# EAGLE schematic esquematicoEagle (EAGLE 9.6.2)
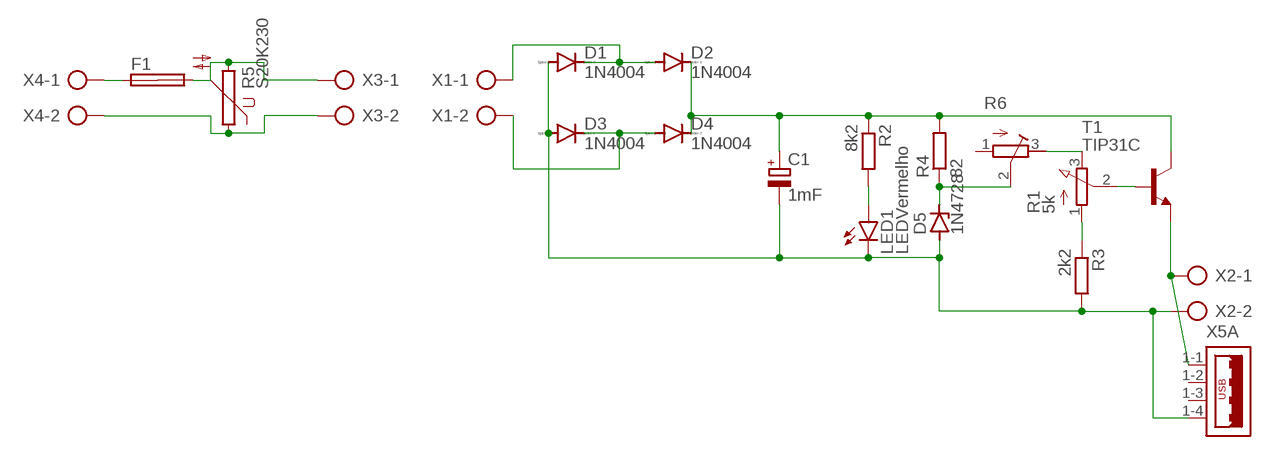
[diagram p0: schematic, sheet 1]

## Parts
C1  1mF  CPOL-EUE5-10.5  [E5-10,5]
D1  1N4004  [DO41-10]
D2  1N4004  [DO41-10]
D3  1N4004  [DO41-10]
D4  1N4004  [DO41-10]
D5  1N4728  [DO41Z10]
F1  SHK20L  [SHK20L]
LED1  LEDVermelho  LED5MM  [LED5MM]
R1  5k  3RP/1610N  [3RP/1610N]
R2  8k2  R-EU_0204/7  [0204/7]
R3  2k2  R-EU_0204/7  [0204/7]
R4  82  R-EU_0204/7  [0204/7]
R5  S20K230  [S20K230]
R6  R-TRIMM3296W  [RTRIM3296W]
T1  TIP31C  [TO220]
X1  AK500/2-H  [AK500/2-H]
X2  AK500/2-H  [AK500/2-H]
X3  AK500/2-H  [AK500/2-H]
X4  AK500/2-H  [AK500/2-H]
X5  USB_4-32003-40XA  [32003-40XA]

## Nets
N$1: C1.- D1.A D3.A D5.A LED1.K(C) R3.2 X2.2 X5.1-4
N$2: D1.C D2.A X1.1
N$3: C1.+ D2.C D4.C R2.1 R4.2 T1.2(C)
N$4: D3.C D4.A X1.2
N$5: LED1.A R2.2
N$6: D5.C R4.1 R6.2(S)
N$7: R1.3(E) R6.3(E)
N$8: R1.1(A) R3.1
N$9: R1.2(S) T1.1(B)
N$10: T1.3(E) X2.1 X5.1-1
N$11: F1.1A X4.1
N$12: R5.1 X3.2 X4.2
N$13: F1.2A R5.2 X3.1
Unconnected: F1.1B F1.2B R6.1(A) X5.1-2 X5.1-3 X5.2-1 X5.2-2 X5.2-3 X5.2-4 X5.3-1 X5.3-2 X5.3-3 X5.3-4 X5.4-1 X5.4-2 X5.4-3 X5.4-4

## Library data of the parts
C1 = rcl:CPOL-EU: POLARIZED CAPACITOR, European symbol; SPICEPREFIX: C
D1-D4 = diode:1N4004: DIODE general purpose rectifier, 1 A
D5 = diode:1N4728: Z DIODE 3.3 V, 1W, 5 percent
F1 = fuse:SHK20L: FUSE HOLDER 5 x 20 mm, SH contact, SHH1 Schukat, E1073 Buerklin; OC_FARNELL: unknown; OC_NEWARK: unknown
LED1 = led:LED: LED OSRAM: - CHIPLED LG R971, LG N971, LY N971, LG Q971, LY Q971, LO R971, LY R971 LH N974, LH R974 LS Q976, LO Q976, LY Q976 LO Q996 - Hyper CHIPLED LW Q18S LB Q993, LB Q99A, LB R99A - SideLED LS A670, LO A670, LY A670, LG A670, LP A670 LB A673, LV A673, LT A673, LW A673 LH A674 LY A675 LS A676, LA A676, LO A676, LY A676, LW A676 LS A679, LY A679, LG A679 - Hyper Micro SIDELED® LS Y876, LA Y876, LO Y876, LY Y876 LT Y87S - SmartLED LW L88C, LW L88S LB L89C, LB L89S, LG L890 LS L89K, LO L89K, LY L89K LS L896, LA L896, LO L896, LY L896 - TOPLED LS T670, LO T670, LY T670, LG T670, LP T670 LSG T670, LSP T670, LSY T670, LOP T670, LYG T670 LG T671, LOG T671, LSG T671 LB T673, LV T673, LT T673, LW T673 LH T674 LS T676, LA T676, LO T676, LY T676, LB T676, LH T676, LSB T676, LW T676 LB T67C, LV T67C, LT T67C, LS T67K, LO T67K, LY T67K, LW E67C LS E67B, LA E67B, LO E67B, LY E67B, LB E67C, LV E67C, LT E67C LW T67C LS T679, LY T679, LG T679 LS T770, LO T770, LY T770, LG T770, LP T770 LB T773, LV T773, LT T773, LW T773 LH T774 LS E675, LA E675, LY E675, LS T675 LS T776, LA T776, LO T776, LY T776, LB T776 LHGB T686 LT T68C, LB T68C - Hyper Mini TOPLED® LB M676 - Mini TOPLED Santana® LG M470 LS M47K, LO M47K, LY M47K Source: http://www.osram.convergy.de LUXEON: - LUMILED® LXK2-PW12-R00, LXK2-PW12-S00, LXK2-PW14-U00, LXK2-PW14-V00 LXK2-PM12-R00, LXK2-PM12-S00, LXK2-PM14-U00 LXK2-PE12-Q00, LXK2-PE12-R00, LXK2-PE12-S00, LXK2-PE14-T00, LXK2-PE14-U00 LXK2-PB12-K00, LXK2-PB12-L00, LXK2-PB12-M00, LXK2-PB14-N00, LXK2-PB14-P00, LXK2-PB14-Q00 LXK2-PR12-L00, LXK2-PR12-M00, LXK2-PR14-Q00, LXK2-PR14-R00 LXK2-PD12-Q00, LXK2-PD12-R00, LXK2-PD12-S00 LXK2-PH12-R00, LXK2-PH12-S00 LXK2-PL12-P00, LXK2-PL12-Q00, LXK2-PL12-R00 Source: www.luxeon.com KINGBRIGHT: KA-3528ASYC Source: www.kingbright.com
R1 = pot:3RP/1610N: 16mm Potentiometer one level Source: http://www.alphapotentiometers.net/html/16mm_pot_2.html
R2-R4 = rcl:R-EU_: RESISTOR, European symbol; SPICEPREFIX: R
R5 = varistor:S20K230: VARISTOR
R6 = rcl:R-TRIMM: Trimm resistor; SPICEMODEL: X; SPICEPREFIXL: POT
T1 = transistor-neu-to92:TIP31C: NPN TRANSISTOR
X1-X4 = con-ptr500:AK500/2-H: CONNECTOR Aug. 2004 / PTR Meßtechnik: Die Bezeichnung der Serie AK505 wurde geändert. Es handelt sich hierbei um AK500 in horizontaler Ausführung.; OC_FARNELL: unknown; OC_NEWARK: unknown
X5 = con-cypressindustries:USB_4-: USB Quad Source: www.cypressindustries.com; OC_FARNELL: unknown; OC_NEWARK: unknown